# EAGLE design isolated-rj45-revb (EAGLE 9.4.0)
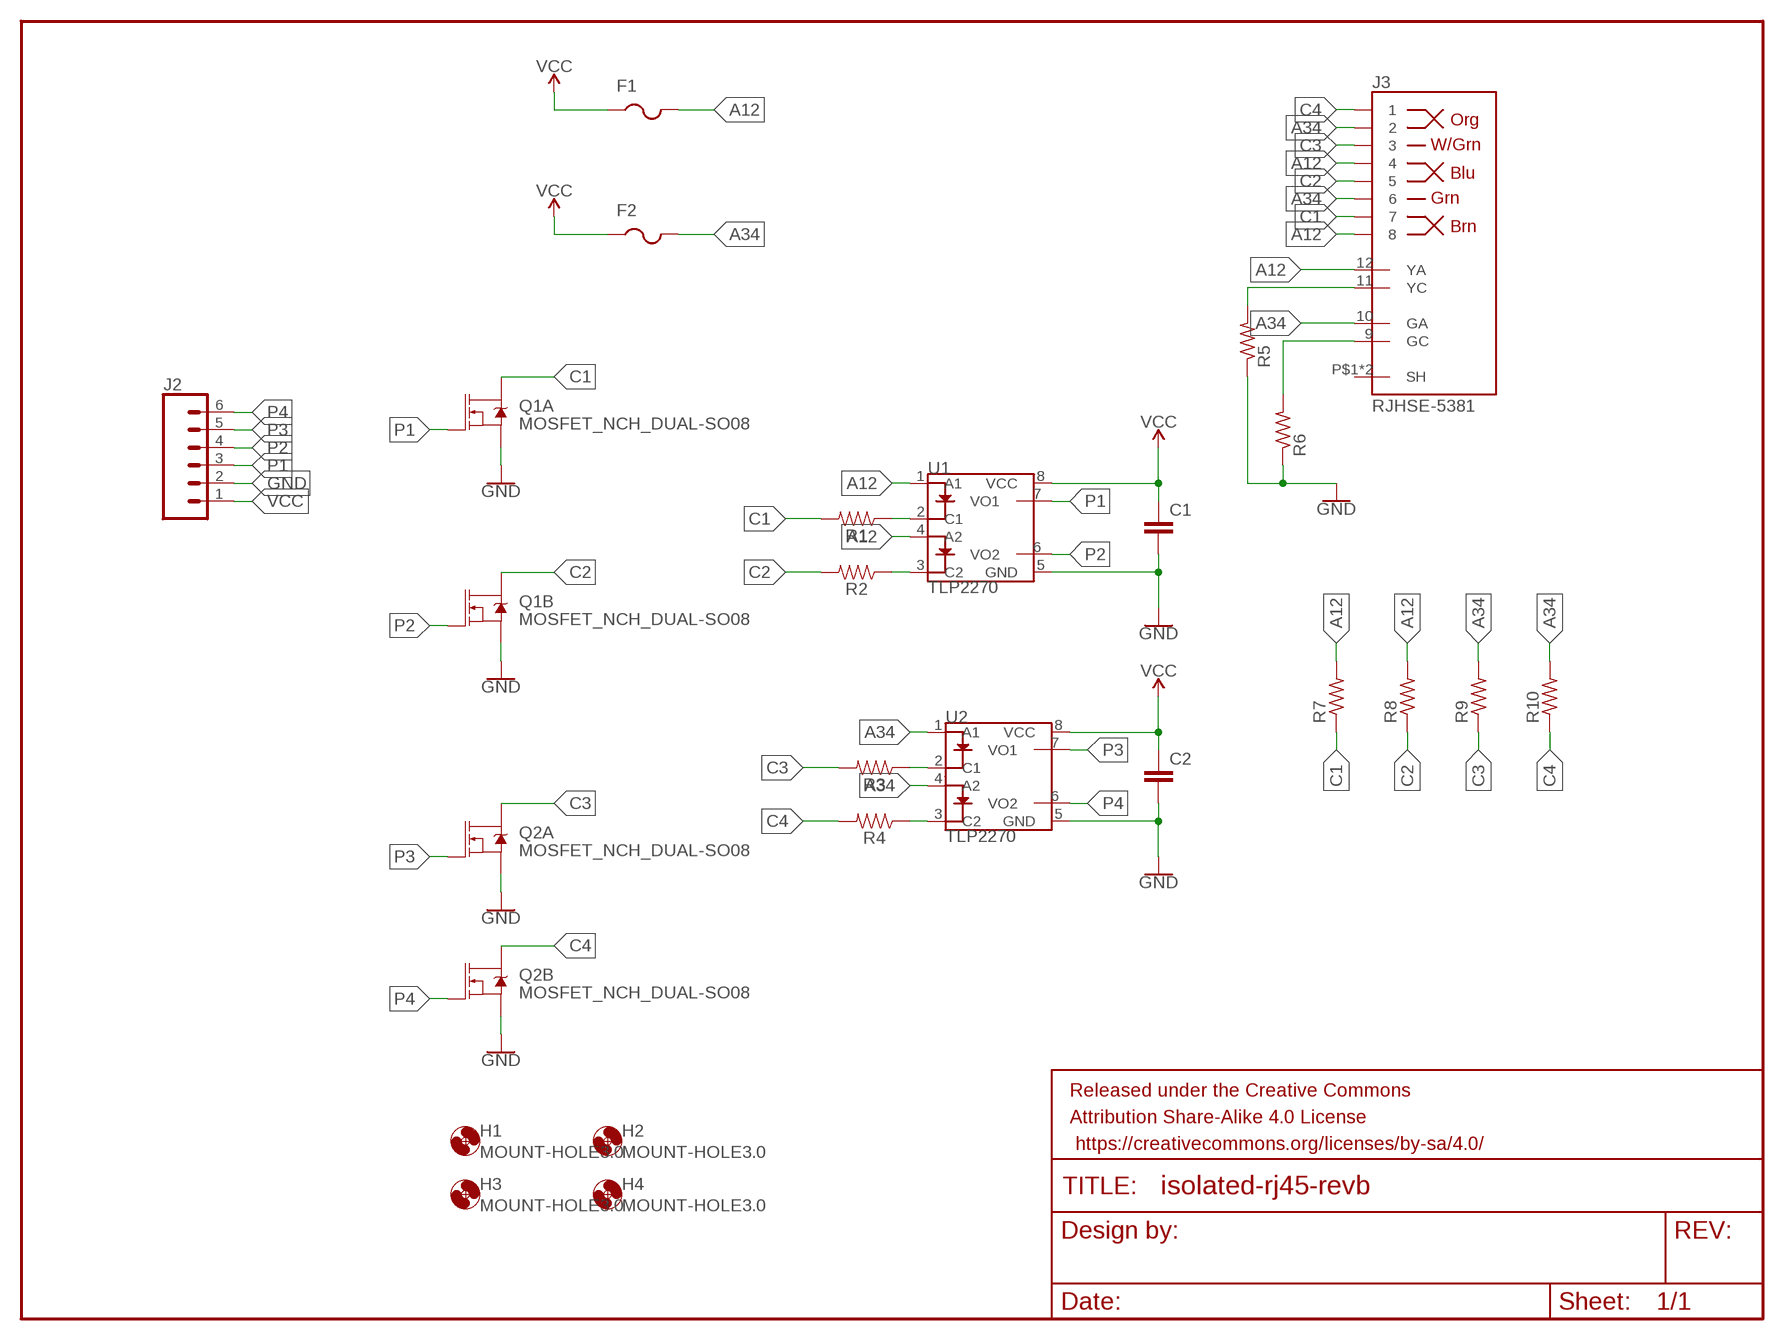
[diagram p0: schematic, sheet 1]

## Parts
C1  CAPACITOR_0603_L  [RESC0603_L]
C2  CAPACITOR_0603_L  [RESC0603_L]
F1  PTCFUSE-1206  [R1206]
F2  PTCFUSE-1206  [R1206]
FRAME1  FRAME-LETTERNO_PACKAGE  [DUMMY]
H1  MOUNT-HOLE3.0  [3,0]
H2  MOUNT-HOLE3.0  [3,0]
H3  MOUNT-HOLE3.0  [3,0]
H4  MOUNT-HOLE3.0  [3,0]
J2  CONN_06SILK_FEMALE_PTH  [1X06]
J3  RJHSE-5381  [RJHSE-538X]
Q1  MOSFET_NCH_DUAL-SO08  [SO08]
Q2  MOSFET_NCH_DUAL-SO08  [SO08]
R1  RESISTOR0603  [0603]
R2  RESISTOR0603  [0603]
R3  RESISTOR0603  [0603]
R4  RESISTOR0603  [0603]
R5  R-US_R0603  [R0603]
R6  R-US_R0603  [R0603]
R7  R-US_R0603  [R0603]
R8  R-US_R0603  [R0603]
R9  R-US_R0603  [R0603]
R10  R-US_R0603  [R0603]
U1  TLP2270  DUAL-OPTOISOLATOR-PPTLP2270  [11-6B1A]
U2  TLP2270  DUAL-OPTOISOLATOR-PPTLP2270  [11-6B1A]

## Nets
A12: F1.2 J3.4 J3.8 J3.12(YA) R7.2 R8.2 U1.1(A1) U1.4(A2)
A34: F2.2 J3.2 J3.6 J3.10(GA) R9.2 R10.2 U2.1(A1) U2.4(A2)
C1: J3.7 Q1.7(A:D) Q1.8(A:D) R1.2 R7.1
C2: J3.5 Q1.5(B:D) Q1.6(B:D) R2.2 R8.1
C3: J3.3 Q2.7(A:D) Q2.8(A:D) R3.2 R9.1
C4: J3.1 Q2.5(B:D) Q2.6(B:D) R4.2 R10.1
GND: C1.2 C2.2 J2.2 Q1.1(A:S) Q1.3(B:S) Q2.1(A:S) Q2.3(B:S) R5.1 R6.1 U1.5(GND) U2.5(GND)
N$1: R1.1 U1.2(C1)
N$2: R2.1 U1.3(C2)
N$3: R3.1 U2.2(C1)
N$4: R4.1 U2.3(C2)
N$5: J3.11(YC) R5.2
N$6: J3.9(GC) R6.2
P1: J2.3 Q1.2(A:G) U1.7(VO1)
P2: J2.4 Q1.4(B:G) U1.6(VO2)
P3: J2.5 Q2.2(A:G) U2.7(VO1)
P4: J2.6 Q2.4(B:G) U2.6(VO2)
VCC: C1.1 C2.1 F1.1 F2.1 J2.1 U1.8(VCC) U2.8(VCC)
Unconnected: J3.P$1(SH) J3.P$2(SH)

## Library data of the parts
C1 C2 = Nordic_nRF:CAPACITOR: Generic chip capacitor
F1 F2 = adafruit:PTCFUSE: PTC fuses, resettable thermistors
FRAME1 = SparkFun-Aesthetics:FRAME-LETTER: Schematic Frame - Letter Standard 8.5x11 US Letter frame; DESIGNER: Nobody; VERSION: v01
H1-H4 = holes:MOUNT-HOLE: MOUNTING HOLE with drill center marker
J2 = SparkFun-Connectors:CONN_06: Multi connection point. Often used as Generic Header-pin footprint for 0.1 inch spaced/style header connections On any of the 0.1 inch spaced packages, you can populate with these: Break Away Headers - Straight <https://www.sparkfun.com/products/116> (PRT-00116) Break Away Male Headers - Right Angle <https://www.sparkfun.com/products/553> (PRT-00553) Female Headers <https://www.sparkfun.com/products/115> (PRT-00115) Break Away Headers - Machine Pin <https://www.sparkfun.com/products/117> (PRT-00117) Break Away Female Headers - Swiss Machine Pin <https://www.sparkfun.com/products/743> (PRT-00743) Arduino Stackable Header - 6 Pin <https://www.sparkfun.com/products/9280> (PRT-09280) For SCREWTERMINALS and SPRING TERMINALS visit here: Screw Terimnals on SparkFun.com <https://www.sparkfun.com/search/results?term=Screw+Terminals> (5mm/3.5mm/2.54mm spacing) This device is also useful as a general connection point to wire up your design to another part of your project. Our various solder wires solder well into these plated through hole pads. Hook-Up Wire - Assortment (Stranded, 22 AWG) <https://www.sparkfun.com/products/11375> (PRT-11375) Hook-Up Wire - Assortment (Solid Core, 22 AWG) <https://www.sparkfun.com/products/11367> (PRT-11367) View the entire wire category on our website here <https://www.sparkfun.com/categories/141>; PROD_ID: CONN-08437
J3 = Custom:RJHSE-5381
Q1 Q2 = SparkFun-DiscreteSemi:MOSFET_NCH_DUAL: Dual N-Channel 30-VDS MOSFET Link to datasheet <https://www.fairchildsemi.com/datasheets/FD/FDMA1024NZ.pdf> SparkFun Products: SparkFun Mini FET Shield <https://www.sparkfun.com/products/9627>
R1-R4 = SparkFun-Resistors:RESISTOR: Generic Resistor Package
R5-R10 = adafruit:R-US_: RESISTOR, American symbol
U1 U2 = SparkFun-DiscreteSemi:DUAL-OPTOISOLATOR-PP

## Board
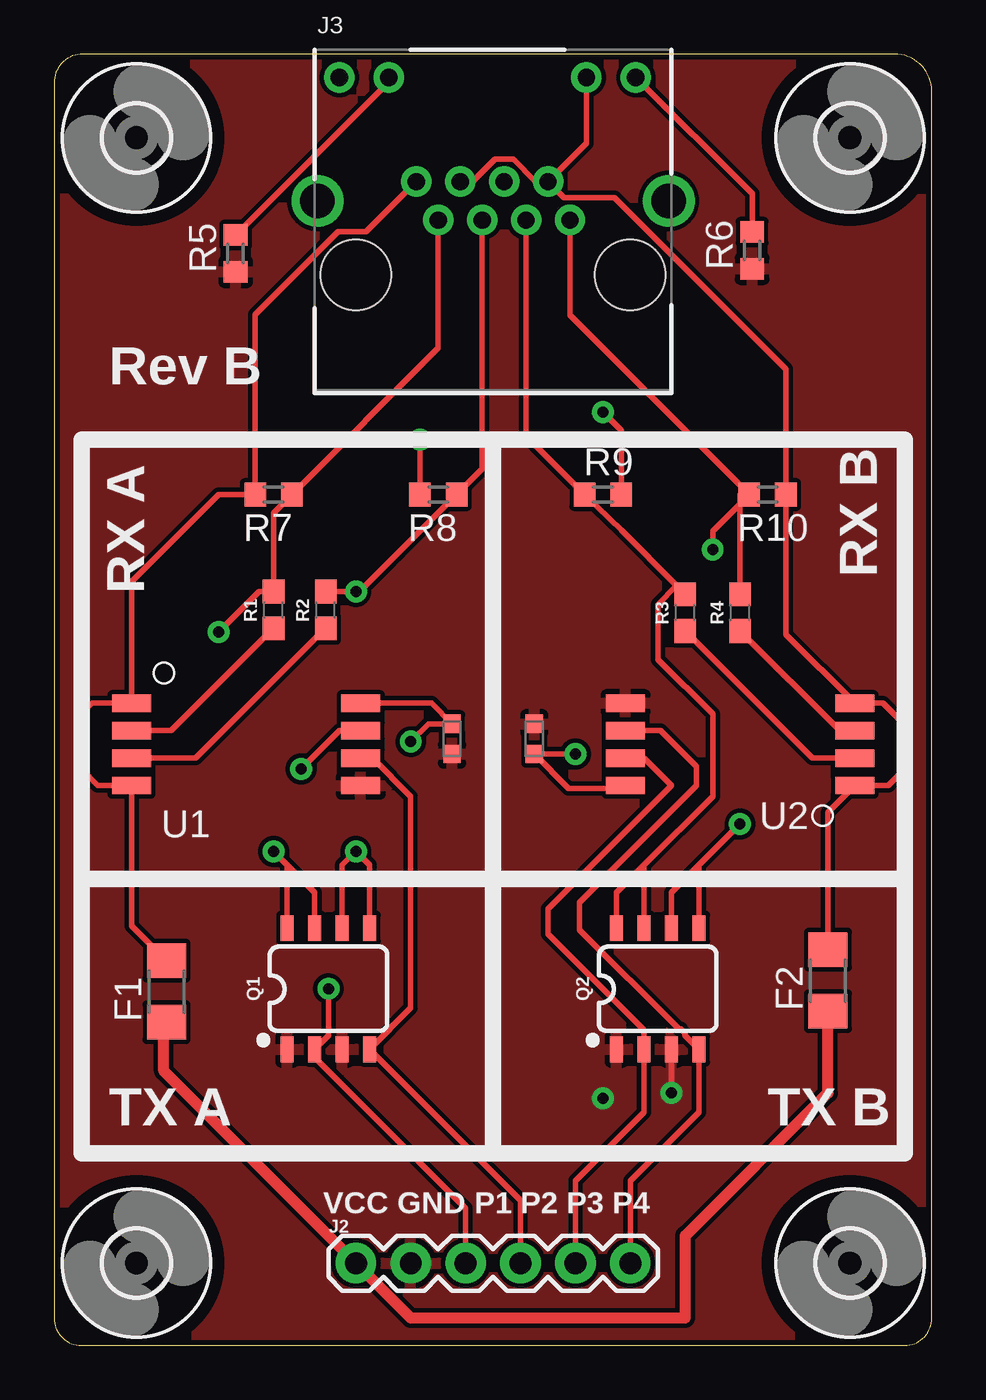
[diagram p1: board, top side]
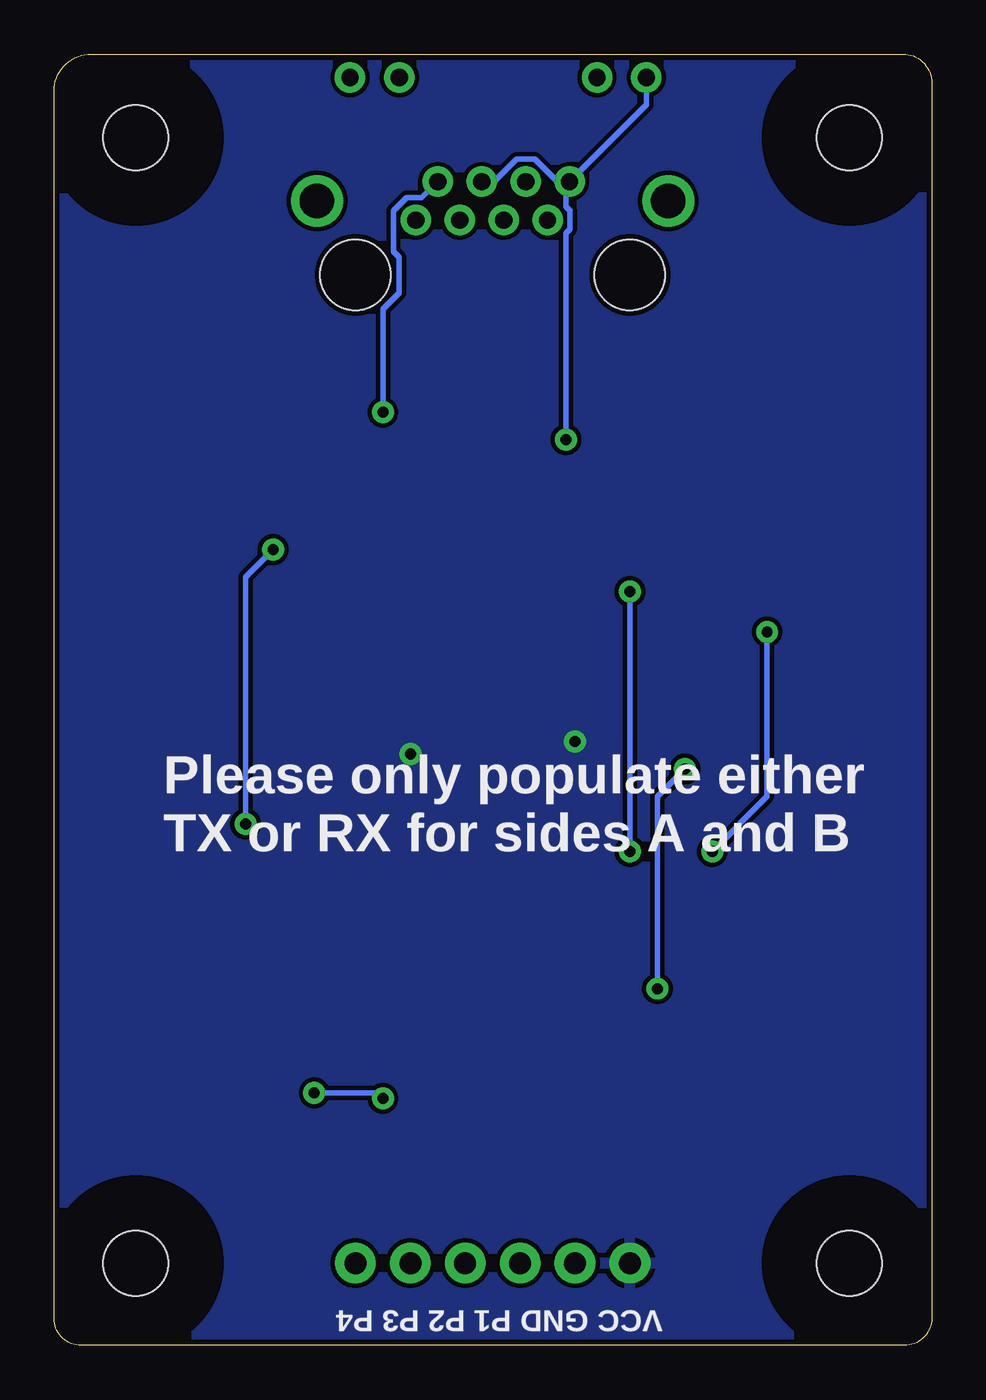
[diagram p2: board, bottom side, seen from below]

Size 40.62 x 59.76 mm. Coordinates in mm from the lower left corner, seen from the top.
Outline: 0,58.42 0,1.27 arc90 1.27,0 39.37,0 arc90 40.62,1.25 40.62,58.03 arc90 38.9,59.76 1.34,59.76 arc90 0,58.42
Copper layers (1*16): Top 0.035mm / dielectric 1.5mm / Bottom 0.035mm
Design rules "SparkFun": minimum track width 8mil, minimum drill 20mil, track to track 8mil, track to pad 8mil, pad to pad 8mil, via to via 8mil, smd to smd 8mil, copper to edge 10mil, drill to drill 8mil, minimum pad ring 12mil, minimum via ring 10mil, stop-mask expansion 4mil, vias tented up to drill 25mil, thermal gap 10mil

### Footprints (pad centres in the part's own frame; a part is rotated, then mirrored left to right if it is on the bottom)
RESC0603_L = smd 0.85 x 0.8: 1 -0.7,0; 2 0.7,0
R1206 = smd 1.6 x 1.803: 1 -1.422,0; 2 1.422,0
3,0 = hole 3: 0,0
1X06 = drill 1.016 pad 1.88: 1 0,0; 2 2.54,0; 3 5.08,0; 4 7.62,0; 5 10.16,0; 6 12.7,0
RJHSE-538X = drill 0.8: 1 3.556,2.54; 2 2.54,4.32; 3 1.524,2.54; 4 0.508,4.32; 5 -0.508,2.54; 6 -1.524,4.32; 7 -2.54,2.54; 8 -3.556,4.32; 9 6.604,9.14; 10 4.318,9.14; 11 -4.826,9.14; 12 -7.112,9.14 | drill 1.6: P$1 -8.128,3.43; P$2 8.128,3.43 | hole 3.251: -6.35,0; 6.35,0
SO08 = smd 0.6 x 1.2: 1 -1.905,-2.8; 2 -0.635,-2.8; 3 0.635,-2.8; 4 1.905,-2.8; 5 1.905,2.8; 6 0.635,2.8; 7 -0.635,2.8; 8 -1.905,2.8
0603 = smd 1.1 x 1: 1 -0.85,0; 2 0.85,0
R0603 = smd 1 x 1.1: 1 -0.85,0; 2 0.85,0
11-6B1A = smd 0.8 x 1.8: 1 3.81,5.3; 2 2.54,5.3; 3 1.27,5.3; 4 0,5.3; 5 0,-5.3; 6 1.27,-5.3; 7 2.54,-5.3; 8 3.81,-5.3

### Placement (x,y rotation side)
C1  18.41,28.07 270 top
C2  22.23,28.07 90 top
F1  5.21,16.38 90 top
F2  35.81,16.89 90 top
FRAME1  -1.27,-2.54 0 top
H1  3.81,55.88 0 top
H2  36.83,55.88 0 top
H3  3.81,3.81 0 top
H4  36.83,3.81 0 top
J2  13.97,3.81 0 top
J3  20.32,49.53 0 top
Q1  12.7,16.51 0 top
Q2  27.94,16.51 0 top
R1  10.16,34.04 90 top
R2  12.57,34.04 90 top
R3  29.21,33.91 90 top
R4  31.75,33.91 90 top
R5  8.4,50.53 90 top
R6  32.31,50.67 90 top
R7  10.16,39.37 180 top
R8  17.78,39.37 180 top
R9  25.4,39.37 0 top
R10  33.02,39.37 0 top
U1  8.89,25.91 90 top
U2  31.75,29.72 270 top

### Tracks (layer width: path | path; a pad name or v marks a point on that pad's centre or on a via)
A12  (via drill 0.51)
  Top 0.254: F1.2 3.59,19.42 U1.4 2.03,25.91 1.27,26.67 1.27,29.21 1.78,29.72 U1.1 3.59,35.34 7.62,39.37 R7.2 9.31,47.71 13.14,51.54 14.45,51.54 J3.8 | R8.2 v16.93,41.91
  Bottom 0.254: J3.8 17.33,53.85 18.37,54.88 19.23,54.88 20.26,53.85 J3.4 | J3.8 13.21,57.41 J3.12 | J3.8 16.93,53.68 16.93,52.68 16.75,52.5 16.75,51.64 16.93,51.46 v16.93,41.91
A34  (via drill 0.51)
  Top 0.254: F2.2 35.81,24.67 U2.1 38.61,25.91 39.37,26.67 39.37,28.7 38.35,29.72 U2.4 33.87,32.9 R10.2 33.87,45.17 25.93,53.1 23.61,53.1 J3.2 | J3.6 19.36,53.85 20.4,54.88 21.26,54.88 22.29,53.85 J3.2 | J3.2 24.64,55.63 J3.10 | R9.2 26.25,42.33 v25.4,43.18
  Bottom 0.254: v25.4,43.18 25.4,47.96 24.66,48.7 24.66,50.36 24.91,50.61 24.91,52.5 24.3,53.1 23.61,53.1 J3.2
C1  (via drill 0.51)
  Top 0.254: Q1.8 10.79,22.23 v10.16,22.86 12.06,20.95 Q1.7 | v7.62,33.02 9.49,34.89 R1.2 10.16,38.52 R7.1 17.78,46.14 J3.7
  Bottom 0.254: v10.16,22.86 7.62,25.4 v7.62,33.02
C2  (via drill 0.51)
  Top 0.254: R2.2 v13.97,34.89 14.15,34.89 R8.1 19.81,40.55 J3.5 | Q1.6 13.34,22.23 v13.97,22.86 14.61,22.23 Q1.5
  Bottom 0.254: v13.97,22.86 v13.97,34.89
C3
  Top 0.254: R3.2 28.81,35.16 | 28.81,35.16 26.25,37.72 R9.1 21.84,42.08 J3.3 | Q2.7 27.3,22.23 | 27.3,22.23 30.48,25.4 30.48,29.21 27.94,31.75 27.94,34.29 28.81,35.16 | Q2.8 26.04,20.95 27.3,22.23
C4  (via drill 0.51)
  Top 0.254: R10.1 31.96,39.58 31.75,39.37 R4.2 | Q2.5 29.84,22.23 | 29.84,22.23 v31.75,24.13 | v30.48,36.83 30.48,37.68 R10.1 | Q2.6 28.57,20.95 29.84,22.23 | R10.1 23.88,47.66 J3.1
  Bottom 0.254: v31.75,24.13 31.75,35.56 v30.48,36.83
GND  (via drill 0.51)
  Top 0.254: Q2.3 v28.57,11.68
  Bottom 0.254: v28.57,11.68 25.4,11.68 v25.4,11.43
  pour Top: -1.27,60.96 41.91,60.96 41.91,-1.27 -1.27,-1.27
N$1
  Top 0.254: R1.1 5.42,28.45 U1.2
N$2
  Top 0.254: U1.3 6.57,27.18 R2.1
N$3
  Top 0.254: U2.2 35.09,27.18 R3.1
N$4
  Top 0.254: R4.1 36.36,28.45 U2.3
N$5
  Top 0.254: R5.2 15.49,58.47 J3.11
N$6
  Top 0.254: R6.2 32.31,53.28 J3.9
P1  (via drill 0.51)
  Top 0.254: J2.3 19.05,6.35 12.06,13.34 Q1.2 12.7,14.35 v12.7,16.51 | v11.43,26.67 13.21,28.45 U1.7
  Bottom 0.254: v12.7,16.51 12.7,25.4 v11.43,26.67
P2
  Top 0.254: J2.4 21.59,6.72 Q1.4 16.51,15.62 16.51,25.4 14.73,27.18 U1.6
P3
  Top 0.254: J2.5 24.13,7.62 27.3,10.79 Q2.2 27.3,14.61 22.86,19.05 22.86,20.19 28.57,25.91 27.3,27.18 U2.7
P4
  Top 0.254: J2.6 26.67,7.62 29.84,10.79 Q2.4 29.2,14.35 29.2,14.45 29.01,14.64 28.91,14.64 24.32,19.24 24.32,20.51 29.72,25.91 29.72,26.8 28.07,28.45 U2.6
VCC  (via drill 0.51)
  Top 0.254: U1.8 17.46,29.72 C1.1 17.34,28.77 v16.51,27.94 | U2.8 26.33,25.78 23.81,25.78 C2.1 v24.13,27.37
  Top 0.508: F1.1 5.08,14.83 5.08,12.7 J2.1 16.51,1.27 29.21,1.27 29.21,5.08 35.81,11.68 F2.1
  pour Bottom: -1.27,60.96 41.91,60.96 41.91,-1.27 -1.27,-1.27

### Text on the board
tPlace: Rev B | RX A | RX B | TX A | TX B | VCC GND P1 P2 P3 P4
bPlace: Please only populate either / TX or RX for sides A and B | VCC GND P1 P2 P3 P4